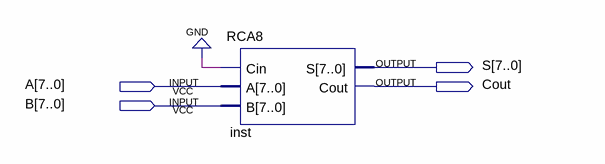
[diagram p0: schematic sheet]
// Quartus schematic RCA8bits.bdf as structural Verilog: 1 symbols, 4 pins
module RCA8bits (
  input  [7:0] A,
  input  [7:0] B,
  output [7:0] S,
  output Cout
);

  RCA8 inst (.Cin(1'b0), .A(A), .B(B), .S(S), .Cout(Cout));
endmodule
